# EAGLE design PI-Shield (EAGLE 9.5.0)

## Sheet 1 of 4
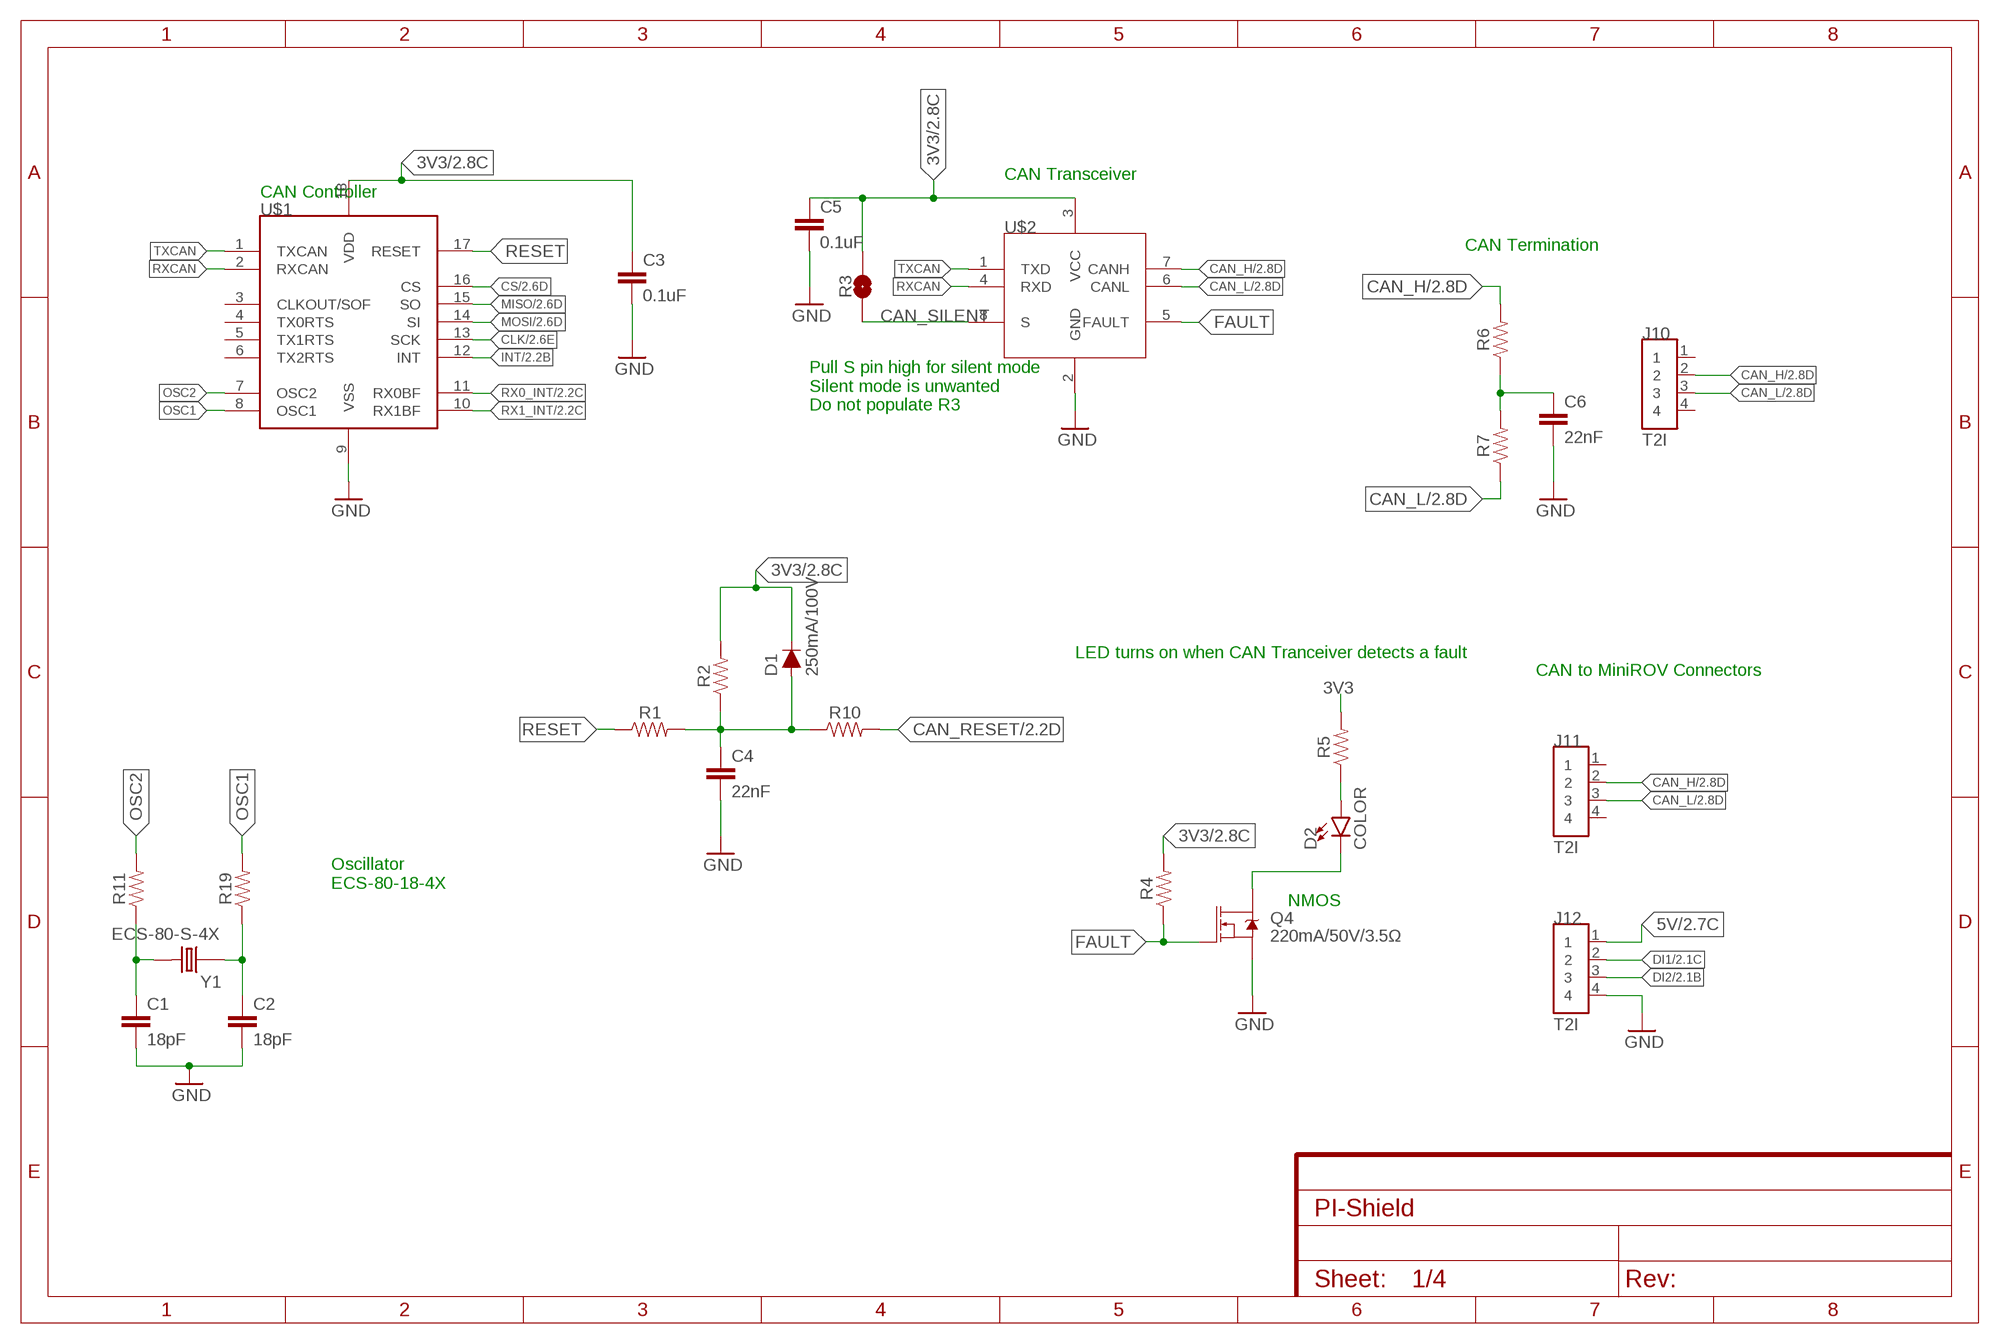
[diagram p0: schematic, sheet 1]

### Parts
C1  18pF  18PF-0603-50V-5%  [0603]
C2  18pF  18PF-0603-50V-5%  [0603]
C3  0.1uF  22NF/22,000PF-0603-50V-10%  [0603]
C4  22nF  22NF/22,000PF-0603-50V-10%  [0603]
C5  0.1uF  22NF/22,000PF-0603-50V-10%  [0603]
C6  22nF  22NF/22,000PF-0603-50V-10%  [0603]
D1  250mA/100V  DIODE-BAS16J  [SOD-323]
D2  COLOR  LED-0805  [0805]
J10  T2I  [T2I]
J11  T2I  [T2I]
J12  T2I  [T2I]
Q4  220mA/50V/3.5Ω  MOSFET-NCH-BSS138  [SOT23-3]
R1  RESISTOR0603  [0603]
R2  RESISTOR0603  [0603]
R3  JUMPER-SMT_2_NO_SILK  [SMT-JUMPER_2_NO_SILK]
R4  RESISTOR0603  [0603]
R5  RESISTOR0603  [0603]
R6  RESISTOR0603  [0603]
R7  RESISTOR0603  [0603]
R10  RESISTOR0603  [0603]
R11  RESISTOR0603  [0603]
R19  RESISTOR0603  [0603]
U$1  MCP2515  [SOIC-18]
U$2  TCAN337D  [SOIC-8]
Y1  ECS-80-S-4X  [XTAL_ECS-80-S-4X]

### Nets
3V3 [3.3V]: C3.1 C5.1 D1.C R2.2 R3.2 R4.2 R5.2 U$1.18(VDD) U$2.3(VCC) ; also sheet 2,3,4
5V [5V]: J12.1 ; also sheet 2,3,4
CAN_H [diff pair]: J10.2 J11.2 R6.2 U$2.7(CANH) ; also sheet 2,4
CAN_L [diff pair]: J10.3 J11.3 R7.1 U$2.6(CANL) ; also sheet 2,4
CAN_RESET: R10.2 ; also sheet 2
CAN_SILENT: R3.1 U$2.8(S)
CAN_TERM_COM: C6.1 R6.1 R7.2
CLK: U$1.13(SCK) ; also sheet 2
CS: U$1.16(CS) ; also sheet 2
DI1: J12.2 ; also sheet 2
DI2: J12.3 ; also sheet 2
FAULT: Q4.1(G) R4.1 U$2.5(FAULT)
GND: C1.2 C2.2 C3.2 C4.2 C5.2 C6.2 J12.4 Q4.2(S) U$1.9(VSS) U$2.2(GND) ; also sheet 2,3,4
INT: U$1.12(INT) ; also sheet 2
MISO: U$1.15(SO) ; also sheet 2
MOSI: U$1.14(SI) ; also sheet 2
N$2: C1.1 R11.1 Y1.2
N$3: C2.1 R19.1 Y1.1
N$7: D2.C Q4.3(D)
N$8: D2.A R5.1
OSC1: R19.2 U$1.8(OSC1)
OSC2: R11.2 U$1.7(OSC2)
RESET: R1.1 U$1.17(RESET)
RESET_MID: C4.1 D1.A R1.2 R2.1 R10.1
RX0_INT: U$1.11(RX0BF) ; also sheet 2
RX1_INT: U$1.10(RX1BF) ; also sheet 2
RXCAN: U$1.2(RXCAN) U$2.4(RXD)
TXCAN: U$1.1(TXCAN) U$2.1(TXD)
Unconnected: J10.1 J10.4 J11.1 J11.4 U$1.3(CLKOUT/SOF) U$1.4(TX0RTS) U$1.5(TX1RTS) U$1.6(TX2RTS)

### Notes on the sheet
- CAN Transceiver
- CAN Controller
- CAN Termination
- Pull S pin high for silent mode
  Silent mode is unwanted
  Do not populate R3
- LED turns on when CAN Tranceiver detects a fault
- CAN to MiniROV Connectors
- Oscillator
  ECS-80-18-4X
- NMOS

## Sheet 2 of 4
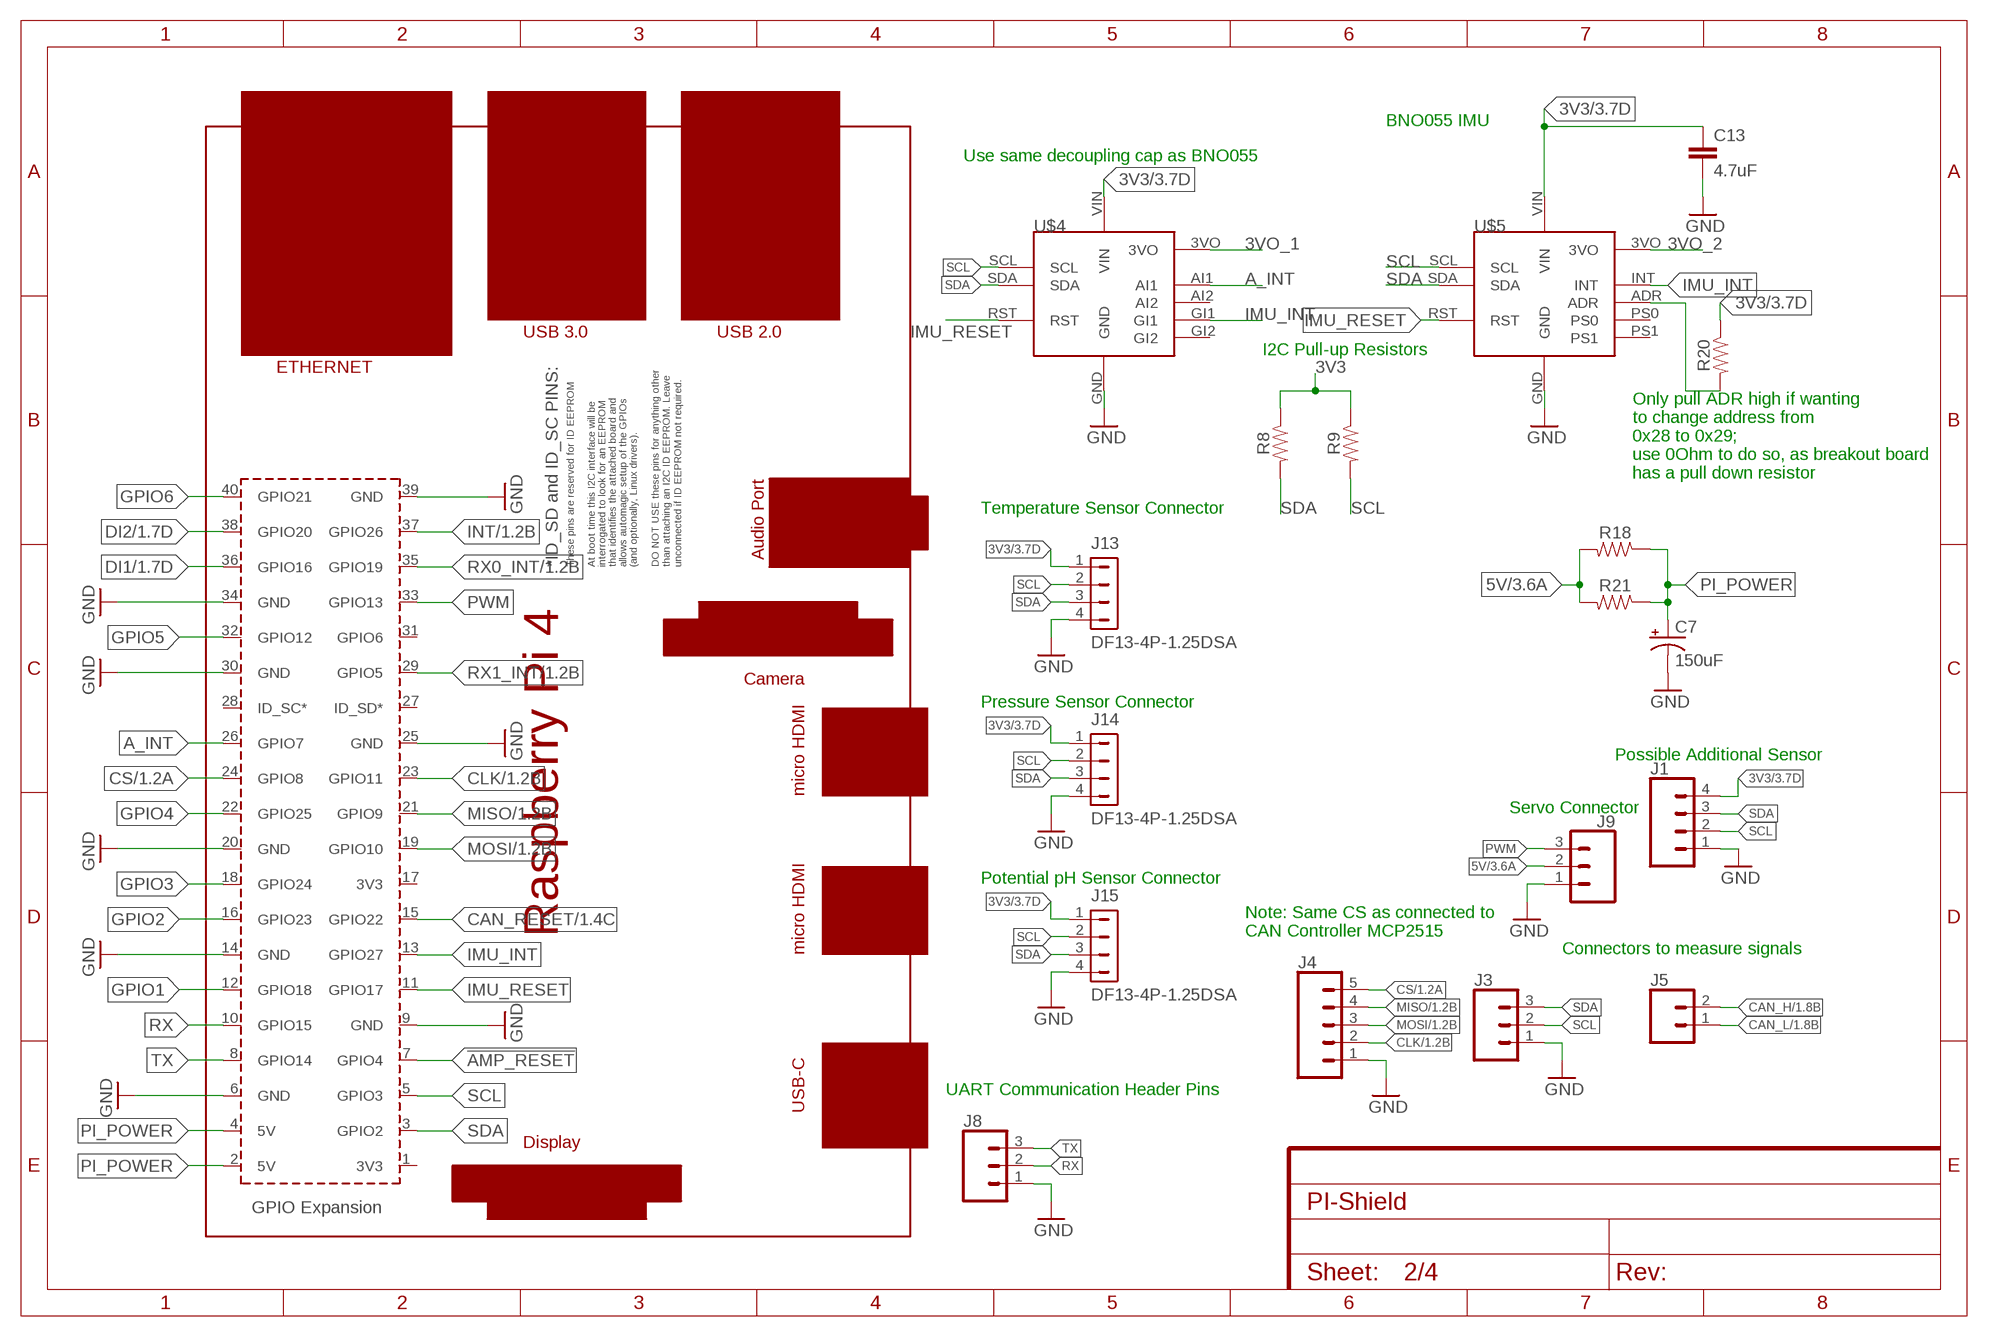
[diagram p1: schematic, sheet 2]

### Parts
C7  150uF  C-TANTALUM(10UF_150UF)  [2917(7343-31-METRIC)]
C13  4.7uF  22NF/22,000PF-0603-50V-10%  [0603]
J1  CONN_04  [1X04]
J3  CONN_03  [1X03]
J4  CONN_05  [1X05]
J5  CONN_02  [1X02]
J8  CONN_03  [1X03]
J9  CONN_03  [1X03]
J13  DF13-4P-1.25DSA  [DF13-4P-1.25DSA]
J14  DF13-4P-1.25DSA  [DF13-4P-1.25DSA]
J15  DF13-4P-1.25DSA  [DF13-4P-1.25DSA]
R8  RESISTOR0603  [0603]
R9  RESISTOR0603  [0603]
R18  RESISTOR0603  [0603]
R20  RESISTOR0603  [0603]
R21  RESISTOR0603  [0603]
U$4  ADAFRUIT-FXOS8700-FXAS21002  [ADAFRUIT-FXOS8700-FXAS21002]
U$5  ADAFRUIT-BNO055  [ADAFRUIT-BNO055]
U$8  RPI4  [RPI4]

### Nets
3V3 [3.3V]: C13.1 J1.4 J13.1 J14.1 J15.1 R8.1 R9.1 R20.1 U$4.VIN U$5.VIN ; also sheet 1,3,4
3VO_1: U$4.3VO
3VO_2: U$5.3VO
5V [5V]: J9.2 R18.2 R21.2 ; also sheet 1,3,4
!AMP_RESET: U$8.7(GPIO4) ; also sheet 3
A_INT: U$4.AI1 U$8.26(GPIO7)
CAN_H [diff pair]: J5.2 ; also sheet 1,4
CAN_L [diff pair]: J5.1 ; also sheet 1,4
CAN_RESET: U$8.15(GPIO22) ; also sheet 1
CLK: J4.2 U$8.23(GPIO11) ; also sheet 1
CS: J4.5 U$8.24(GPIO8) ; also sheet 1
DI1: U$8.36(GPIO16) ; also sheet 1
DI2: U$8.38(GPIO20) ; also sheet 1
GND: C7.- C13.2 J1.1 J3.1 J4.1 J8.1 J9.1 J13.4 J14.4 J15.4 U$4.GND U$5.GND U$8.6(GND) U$8.9(GND) U$8.14(GND) U$8.20(GND) U$8.25(GND) U$8.30(GND) U$8.34(GND) U$8.39(GND) ; also sheet 1,3,4
GPIO1: U$8.12(GPIO18) ; also sheet 4
GPIO2: U$8.16(GPIO23) ; also sheet 4
GPIO3: U$8.18(GPIO24) ; also sheet 4
GPIO4: U$8.22(GPIO25) ; also sheet 4
GPIO5: U$8.32(GPIO12) ; also sheet 4
GPIO6: U$8.40(GPIO21) ; also sheet 4
IMU_INT: U$4.GI1 U$5.INT U$8.13(GPIO27)
IMU_RESET: U$4.RST U$5.RST U$8.11(GPIO17)
INT: U$8.37(GPIO26) ; also sheet 1
MISO: J4.4 U$8.21(GPIO9) ; also sheet 1
MOSI: J4.3 U$8.19(GPIO10) ; also sheet 1
N$1: R20.2 U$5.ADR
PI_POWER: C7.+ R18.1 R21.1 U$8.2(5V) U$8.4(5V)
PWM: J9.3 U$8.33(GPIO13)
RX: J8.2 U$8.10(GPIO15)
RX0_INT: U$8.35(GPIO19) ; also sheet 1
RX1_INT: U$8.29(GPIO5) ; also sheet 1
SCL: J1.2 J3.2 J13.2 J14.2 J15.2 R9.2 U$4.SCL U$5.SCL U$8.5(GPIO3) ; also sheet 3
SDA: J1.3 J3.3 J13.3 J14.3 J15.3 R8.2 U$4.SDA U$5.SDA U$8.3(GPIO2) ; also sheet 3
TX: J8.3 U$8.8(GPIO14)
Unconnected: U$4.AI2 U$4.GI2 U$5.PS0 U$5.PS1 U$8.1(3V3) U$8.17(3V3) U$8.27(ID_SD*) U$8.28(ID_SC*) U$8.31(GPIO6)

### Notes on the sheet
- BNO055 IMU
- Use same decoupling cap as BNO055
- I2C Pull-up Resistors
- Only pull ADR high if wanting
  to change address from
  0x28 to 0x29;
  use 0Ohm to do so, as breakout board
  has a pull down resistor
- Temperature Sensor Connector
- Pressure Sensor Connector
- Possible Additional Sensor
- Servo Connector
- Potential pH Sensor Connector
- Note: Same CS as connected to 
  CAN Controller MCP2515
- Connectors to measure signals
- UART Communication Header Pins

## Sheet 3 of 4
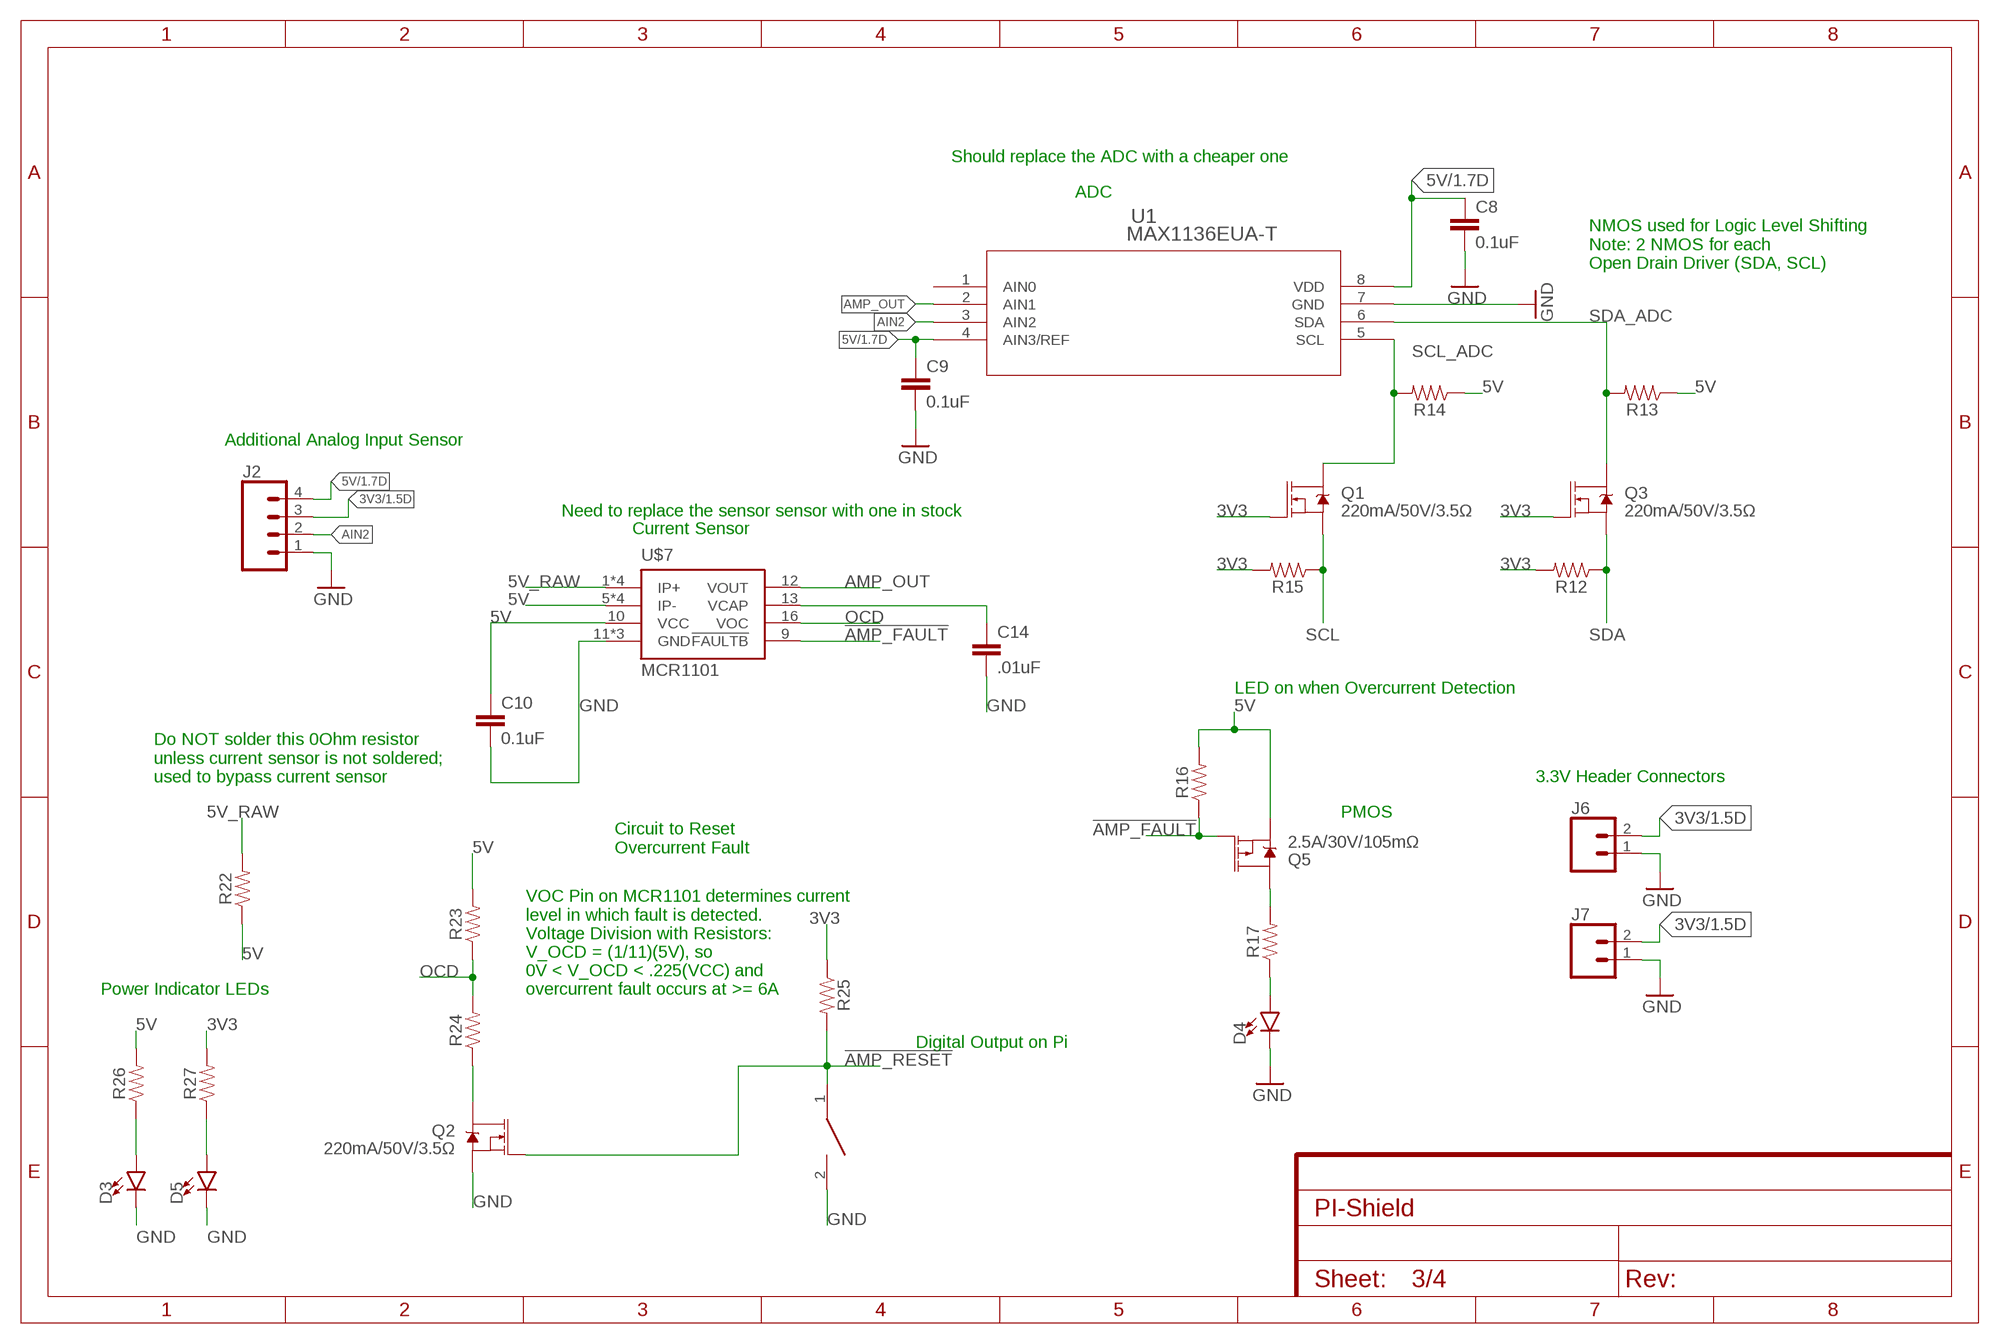
[diagram p2: schematic, sheet 3]

### Parts
C8  0.1uF  22NF/22,000PF-0603-50V-10%  [0603]
C9  0.1uF  22NF/22,000PF-0603-50V-10%  [0603]
C10  0.1uF  22NF/22,000PF-0603-50V-10%  [0603]
C14  .01uF  22NF/22,000PF-0603-50V-10%  [0603]
D3  LED0603  [LED-0603]
D4  LED0603  [LED-0603]
D5  LED0603  [LED-0603]
J2  CONN_04  [1X04]
J6  CONN_02  [1X02]
J7  CONN_02  [1X02]
Q1  220mA/50V/3.5Ω  MOSFET-NCH-BSS138  [SOT23-3]
Q2  220mA/50V/3.5Ω  MOSFET-NCH-BSS138  [SOT23-3]
Q3  220mA/50V/3.5Ω  MOSFET-NCH-BSS138  [SOT23-3]
Q5  2.5A/30V/105mΩ  MOSFET_PCH-DMG2307L  [SOT23-3]
R12  RESISTOR0603  [0603]
R13  RESISTOR0603  [0603]
R14  RESISTOR0603  [0603]
R15  RESISTOR0603  [0603]
R16  RESISTOR0603  [0603]
R17  RESISTOR0603  [0603]
R22  RESISTOR0603  [0603]
R23  RESISTOR0603  [0603]
R24  RESISTOR0603  [0603]
R25  RESISTOR0603  [0603]
R26  RESISTOR0603  [0603]
R27  RESISTOR0603  [0603]
U1  MAX1136EUA-T  [21-0036K]
U$6  DISCRETECOMPONENTS_SWITCH  [DISCRETECOMPONENTS_SW_2512]
U$7  MCR1101  [SOIC-16]

### Nets
3V3 [3.3V]: J2.3 J6.2 J7.2 Q1.1(G) Q3.1(G) R12.2 R15.2 R25.1 R27.2 ; also sheet 1,2,4
5V [5V]: C8.1 C9.1 C10.1 J2.4 Q5.2(S) R13.1 R14.1 R16.2 R22.1 R23.2 R26.2 U1.4(AIN3/REF) U1.8(VDD) U$7.5(IP-) U$7.6(IP-) U$7.7(IP-) U$7.8(IP-) U$7.10(VCC) ; also sheet 1,2,4
5V_RAW: R22.2 U$7.1(IP+) U$7.2(IP+) U$7.3(IP+) U$7.4(IP+)
!AMP_FAULT: Q5.1(G) R16.1 U$7.9(!FAULTB)
!AMP_RESET: Q2.1(G) R25.2 U$6.1 ; also sheet 2
AIN2: J2.2 U1.3(AIN2)
AMP_OUT: U1.2(AIN1) U$7.12(VOUT)
GND: C8.2 C9.2 C10.2 C14.2 D3.C D4.C D5.C J2.1 J6.1 J7.1 Q2.2(S) U1.7(GND) U$6.2 U$7.11(GND) U$7.14(GND) U$7.15(GND) ; also sheet 1,2,4
N$6: C14.1 U$7.13(VCAP)
N$9: D3.A R26.1
N$10: Q5.3(D) R17.2
N$11: D4.A R17.1
N$12: D5.A R27.1
N$13: Q2.3(D) R24.1
OCD: R23.1 R24.2 U$7.16(VOC)
SCL: Q1.2(S) R15.1 ; also sheet 2
SCL_ADC: Q1.3(D) R14.2 U1.5(SCL)
SDA: Q3.2(S) R12.1 ; also sheet 2
SDA_ADC: Q3.3(D) R13.2 U1.6(SDA)
Unconnected: U1.1(AIN0)

### Notes on the sheet
- Should replace the ADC with a cheaper one
- ADC
- NMOS used for Logic Level Shifting
  Note: 2 NMOS for each 
  Open Drain Driver (SDA, SCL)
- Additional Analog Input Sensor
- Need to replace the sensor sensor with one in stock
- Current Sensor
- LED on when Overcurrent Detection
- Do NOT solder this 0Ohm resistor
  unless current sensor is not soldered;
  used to bypass current sensor
- 3.3V Header Connectors
- PMOS
- Circuit to Reset
  Overcurrent Fault
- Power Indicator LEDs
- VOC Pin on MCR1101 determines current
  level in which fault is detected.
  Voltage Division with Resistors:
  V_OCD = (1/11)(5V), so
  0V < V_OCD < .225(VCC) and
  overcurrent fault occurs at >= 6A
- Digital Output on Pi

## Sheet 4 of 4
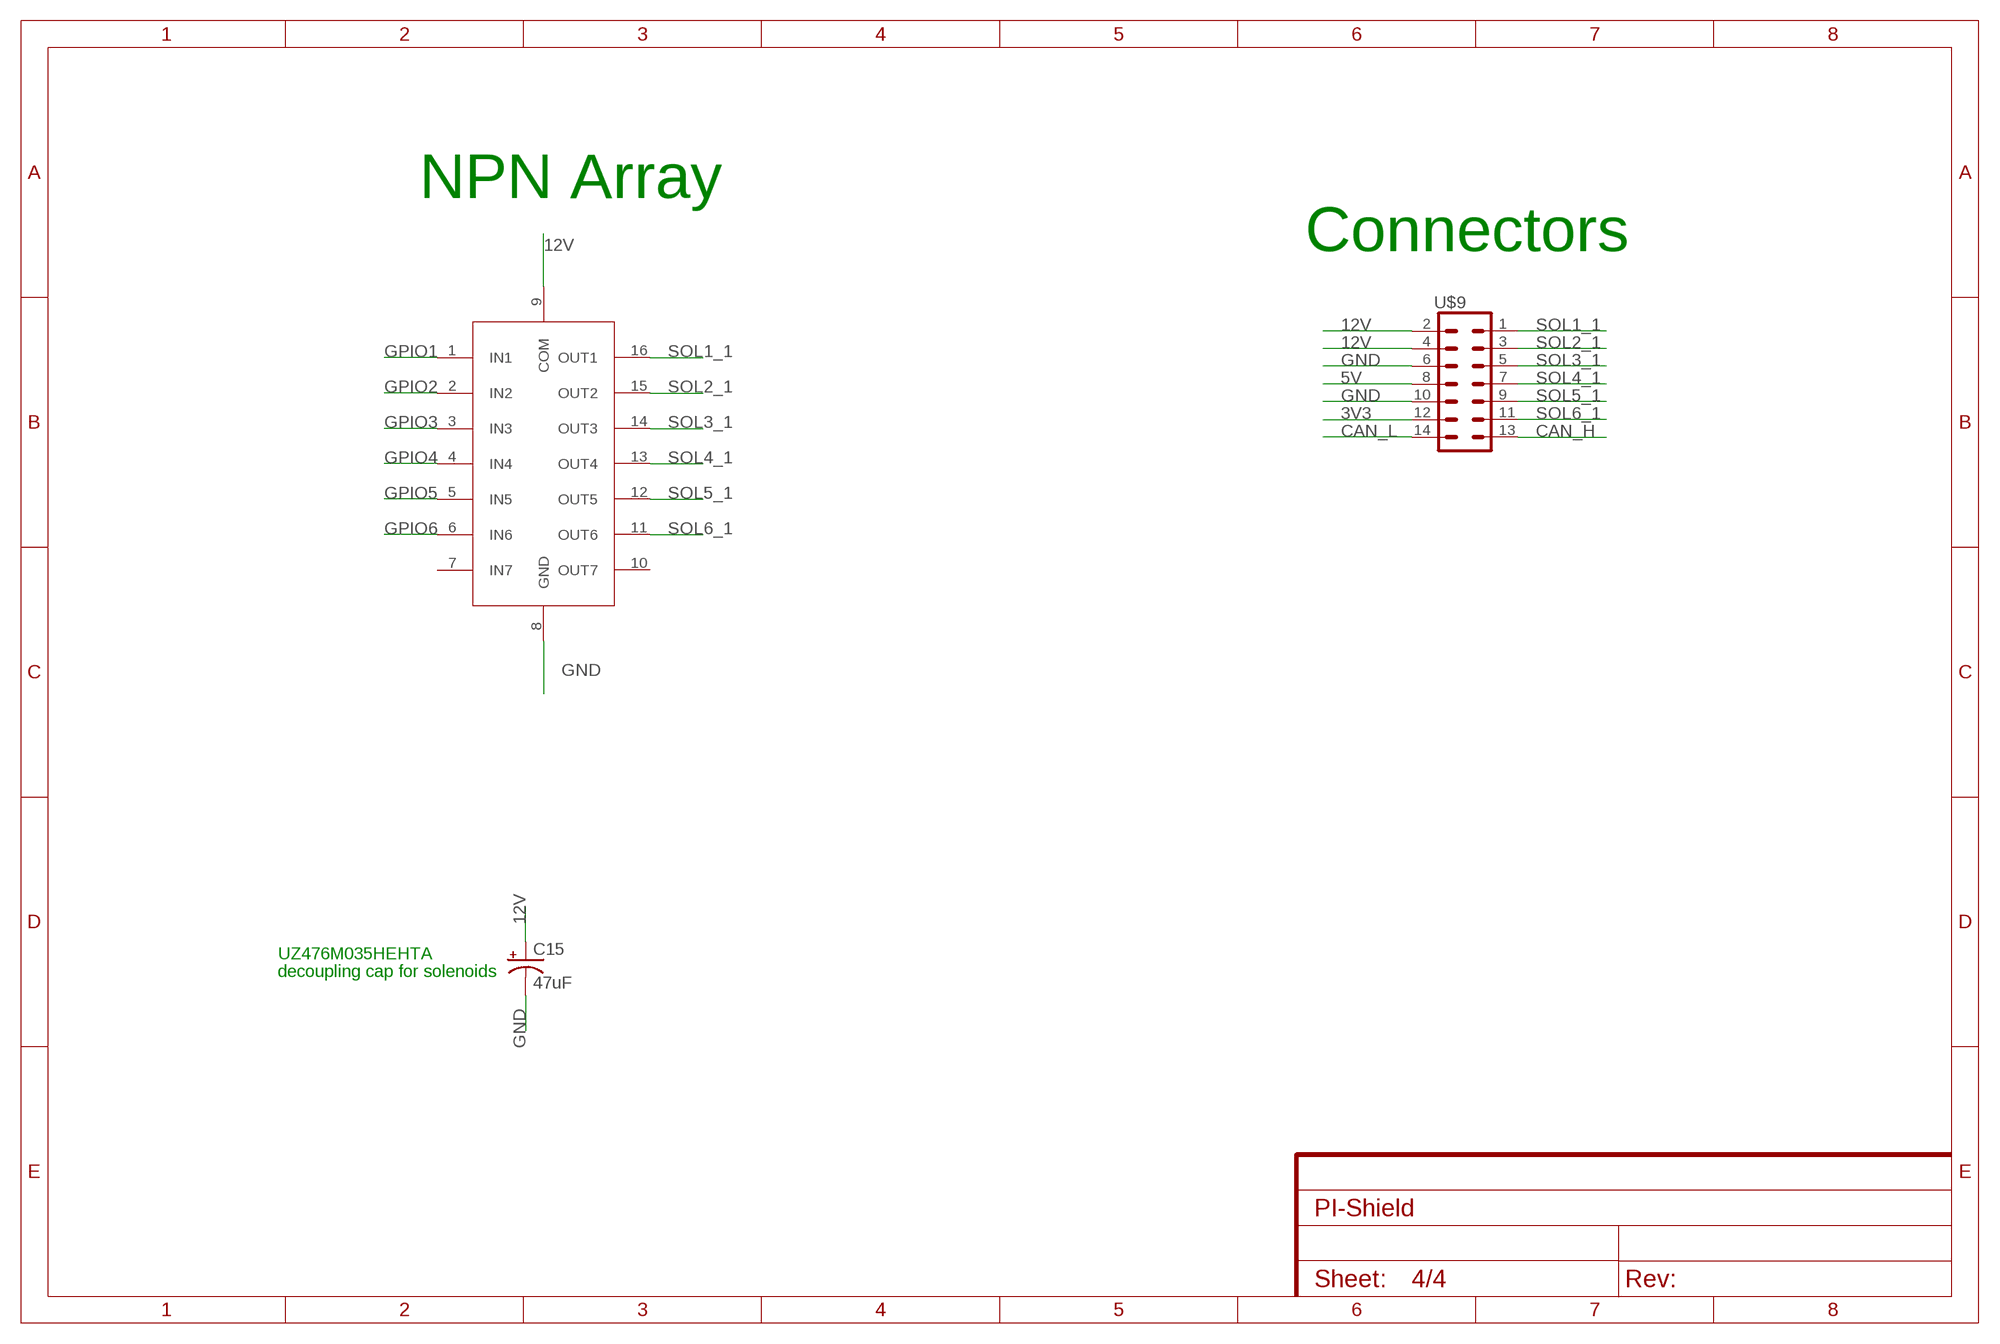
[diagram p3: schematic, sheet 4]

### Parts
C15  47uF  47UF-POLAR-PANASONIC_D-35V-20%  [PANASONIC_D]
U3  ULN2003V12  [ULN2003V12]
U$9  7X_CONN  [IPL7X2]

### Nets
3V3 [3.3V]: U$9.12 ; also sheet 1,2,3
5V [5V]: U$9.8 ; also sheet 1,2,3
12V: C15.+ U3.9(COM) U$9.2 U$9.4
CAN_H [diff pair]: U$9.13 ; also sheet 1,2
CAN_L [diff pair]: U$9.14 ; also sheet 1,2
GND: C15.- U3.8(GND) U$9.6 U$9.10 ; also sheet 1,2,3
GPIO1: U3.1(IN1) ; also sheet 2
GPIO2: U3.2(IN2) ; also sheet 2
GPIO3: U3.3(IN3) ; also sheet 2
GPIO4: U3.4(IN4) ; also sheet 2
GPIO5: U3.5(IN5) ; also sheet 2
GPIO6: U3.6(IN6) ; also sheet 2
SOL1_1: U3.16(OUT1) U$9.1
SOL2_1: U3.15(OUT2) U$9.3
SOL3_1: U3.14(OUT3) U$9.5
SOL4_1: U3.13(OUT4) U$9.7
SOL5_1: U3.12(OUT5) U$9.9
SOL6_1: U3.11(OUT6) U$9.11
Unconnected: U3.7(IN7) U3.10(OUT7)

### Notes on the sheet
- NPN Array
- Connectors
- UZ476M035HEHTA
- decoupling cap for solenoids

## Library data of the parts
C1 C2 = SparkFun-Capacitors:18PF: 18pF ceramic capacitors A capacitor is a passive two-terminal electrical component used to store electrical energy temporarily in an electric field.; PROD_ID: CAP-08267
C3 C5 C8-C10 C13 C14 = SparkFun-Capacitors:22NF/22,000PF: 0.022uF/22nF/22,000pF ceramic capacitors A capacitor is a passive two-terminal electrical component used to store electrical energy temporarily in an electric field.; PROD_ID: CAP-07885; VALUE: 22nF
C4 C6 = SparkFun-Capacitors:22NF/22,000PF: 0.022uF/22nF/22,000pF ceramic capacitors A capacitor is a passive two-terminal electrical component used to store electrical energy temporarily in an electric field.; PROD_ID: CAP-07885
C7 = Tantalum Cap 150 uF - Kemet 2917 T491:C-TANTALUM(10UF_150UF)
C15 = SparkFun-Capacitors:47UF-POLAR: 47µF polarized capacitors A capacitor is a passive two-terminal electrical component used to store electrical energy temporarily in an electric field.; PROD_ID: CAP-08478
D1 = SparkFun-DiscreteSemi:DIODE: Diode These are standard reverse protection diodes and small signal diodes. SparkFun Products: SparkFun SparkPunk Sound Kit <https://www.sparkfun.com/products/11177> SparkFun ESP8266 Thing <https://www.sparkfun.com/products/13231>; PROD_ID: DIO-09646
D2 = LED-0805:LED-0805
D3-D5 = SparkFun-LED:LED: LED (Generic) Standard schematic elements and footprints for 5mm, 3mm, 1206, and 0603 sized LEDs. Generic LEDs with no color specified.
J1 J2 = SparkFun-Connectors:CONN_04: Multi connection point. Often used as Generic Header-pin footprint for 0.1 inch spaced/style header connections On any of the 0.1 inch spaced packages, you can populate with these: Break Away Headers - Straight <https://www.sparkfun.com/products/116> (PRT-00116) Break Away Male Headers - Right Angle <https://www.sparkfun.com/products/553> (PRT-00553) Female Headers <https://www.sparkfun.com/products/115> (PRT-00115) Break Away Headers - Machine Pin <https://www.sparkfun.com/products/117> (PRT-00117) Break Away Female Headers - Swiss Machine Pin <https://www.sparkfun.com/products/743> (PRT-00743) For SCREWTERMINALS and SPRING TERMINALS visit here: Screw Terimnals on SparkFun.com <https://www.sparkfun.com/search/results?term=Screw+Terminals> (5mm/3.5mm/2.54mm spacing) This device is also useful as a general connection point to wire up your design to another part of your project. Our various solder wires solder well into these plated through hole pads. Hook-Up Wire - Assortment (Stranded, 22 AWG) <https://www.sparkfun.com/products/11375> (PRT-11375) Hook-Up Wire - Assortment (Solid Core, 22 AWG) <https://www.sparkfun.com/products/11367> (PRT-11367) View the entire wire category on our website here <https://www.sparkfun.com/categories/141> Special notes: Molex polarized connector foot print use with SKU : PRT-08231 with associated crimp pins and housings. 1MM SMD Version SKU: PRT-10208; PROD_ID: CONN-09696
J3 J8 J9 = SparkFun-Connectors:CONN_03: Multi connection point. Often used as Generic Header-pin footprint for 0.1 inch spaced/style header connections On any of the 0.1 inch spaced packages, you can populate with these: Break Away Headers - Straight <https://www.sparkfun.com/products/116> (PRT-00116) Break Away Male Headers - Right Angle <https://www.sparkfun.com/products/553> (PRT-00553) Female Headers <https://www.sparkfun.com/products/115> (PRT-00115) Break Away Headers - Machine Pin <https://www.sparkfun.com/products/117> (PRT-00117) Break Away Female Headers - Swiss Machine Pin <https://www.sparkfun.com/products/743> (PRT-00743) Stackable Header - 3 Pin (Female, 0.1") <https://www.sparkfun.com/products/13875> (PRT-13875) For SCREWTERMINALS and SPRING TERMINALS visit here: Screw Terimnals on SparkFun.com <https://www.sparkfun.com/search/results?term=Screw+Terminals> (5mm/3.5mm/2.54mm spacing) This device is also useful as a general connection point to wire up your design to another part of your project. Our various solder wires solder well into these plated through hole pads. Hook-Up Wire - Assortment (Stranded, 22 AWG) <https://www.sparkfun.com/products/11375> (PRT-11375) Hook-Up Wire - Assortment (Solid Core, 22 AWG) <https://www.sparkfun.com/products/11367> (PRT-11367) View the entire wire category on our website here <https://www.sparkfun.com/categories/141> Special notes: Molex polarized connector foot print use with SKU : PRT-08232 with associated crimp pins and housings.
J4 = SparkFun-Connectors:CONN_05: Multi connection point. Often used as Generic Header-pin footprint for 0.1 inch spaced/style header connections On any of the 0.1 inch spaced packages, you can populate with these: Break Away Headers - Straight <https://www.sparkfun.com/products/116> (PRT-00116) Break Away Male Headers - Right Angle <https://www.sparkfun.com/products/553> (PRT-00553) Female Headers <https://www.sparkfun.com/products/115> (PRT-00115) Break Away Headers - Machine Pin <https://www.sparkfun.com/products/117> (PRT-00117) Break Away Female Headers - Swiss Machine Pin <https://www.sparkfun.com/products/743> (PRT-00743) For SCREWTERMINALS and SPRING TERMINALS visit here: Screw Terimnals on SparkFun.com <https://www.sparkfun.com/search/results?term=Screw+Terminals> (5mm/3.5mm/2.54mm spacing) This device is also useful as a general connection point to wire up your design to another part of your project. Our various solder wires solder well into these plated through hole pads. Hook-Up Wire - Assortment (Stranded, 22 AWG) <https://www.sparkfun.com/products/11375> (PRT-11375) Hook-Up Wire - Assortment (Solid Core, 22 AWG) <https://www.sparkfun.com/products/11367> (PRT-11367) View the entire wire category on our website here <https://www.sparkfun.com/categories/141> Special notes: Molex polarized connector foot print use with SKU : PRT-08231 with associated crimp pins and housings. 1MM SMD Version SKU: PRT-10208
J5-J7 = SparkFun-Connectors:CONN_02: Multi connection point. Often used as Generic Header-pin footprint for 0.1 inch spaced/style header connections On any of the 0.1 inch spaced packages, you can populate with these: Break Away Headers - Straight <https://www.sparkfun.com/products/116> (PRT-00116) Break Away Male Headers - Right Angle <https://www.sparkfun.com/products/553> (PRT-00553) Female Headers <https://www.sparkfun.com/products/115> (PRT-00115) Break Away Headers - Machine Pin <https://www.sparkfun.com/products/117> (PRT-00117) Break Away Female Headers - Swiss Machine Pin <https://www.sparkfun.com/products/743> (PRT-00743) For SCREWTERMINALS and SPRING TERMINALS visit here: Screw Terimnals on SparkFun.com <https://www.sparkfun.com/search/results?term=Screw+Terminals> (5mm/3.5mm/2.54mm spacing) This device is also useful as a general connection point to wire up your design to another part of your project. Our various solder wires solder well into these plated through hole pads. Hook-Up Wire - Assortment (Stranded, 22 AWG) <https://www.sparkfun.com/products/11375> (PRT-11375) Hook-Up Wire - Assortment (Solid Core, 22 AWG) <https://www.sparkfun.com/products/11367> (PRT-11367) View the entire wire category on our website here <https://www.sparkfun.com/categories/141> Special notes: Molex polarized connector foot print use with: PRT-08233 with associated crimp pins and housings. 2.54_SCREWTERM for use with PRT-10571. 3.5mm Screw Terminal footprints for PRT-08084 5mm Screw Terminal footprints for use with PRT-08432
J10-J12 = Samtec t2i:T2I
J13-J15 = con-hirose-df13:DF13-4P-1.25: DF13-4P 1.25mm Pitch Miniature Crimping Connector.
Q1-Q4 = SparkFun-DiscreteSemi:MOSFET-NCH: N-channel MOSFETs Voltage controlled devices that allow control of high current outputs. SparkFun Products: SparkFun OpenScale <https://www.sparkfun.com/products/13261> SparkFun Digital Sandbox <https://www.sparkfun.com/products/12651> SparkFun Monster Moto Shield <https://www.sparkfun.com/products/10182> SparkFun MOSFET Power Controller <https://www.sparkfun.com/products/11214>; PROD_ID: TRANS-00830
Q5 = SparkFun-DiscreteSemi:MOSFET_PCH: P-channel MOSFETs Voltage controlled devices that allow control of high current outputs. SparkFun Products: SparkFun ESP32 Thing <https://www.sparkfun.com/products/13907> SparkFun ESP8266 Thing <https://www.sparkfun.com/products/13231>; PROD_ID: TRANS-11308
R1 R2 R4-R27 = SparkFun-Resistors:RESISTOR: Generic Resistor Package
R3 = SparkFun-Jumpers:JUMPER-SMT_2_NO: Normally open jumper This jumper has two pads in close proximity to each other. Apply solder to close the connection. Round pads are easier to solder for beginners, but are a lot larger. SparkFun Product that uses the round pads: SparkFun EL Sequencer <https://www.sparkfun.com/products/12781>
U1 = MAX1136EUA-T:MAX1136EUA-T; DESCRIPTION: 2.7V to 3.6V and 4.5V to 5.5V, Low-Power, 4-/12-Channel, 2-Wire Serial 10-Bit AD; DIGI-KEY_PART_NUMBER: MAX1136EUA+-ND; DIGI-KEY_PURCHASE_URL: https://www.digikey.com/product-detail/en/maxim-integrated/MAX1136EUA-/MAX1136EUA--ND/1159953?utm_source=snapeda&utm_medium=aggregator&utm_campaign=symbol; MF: Maxim Integrated; MP: MAX1136EUA+; PACKAGE: MSOP-8 Maxim Integrated
U3 = ULN2003V12:ULN2003V12; A1_MIN: 0.25; A_MAX: 1.75; A_MIN: 1.75; A_NOM: 1.75; B_MAX: 0.51; B_MIN: 0.33; B_NOM: 0.42; D2_MAX: 0.0; D_MAX: 10.0; D_MIN: 9.8; D_NOM: 9.9; E1_MAX: 4.0; E1_MIN: 3.8; E1_NOM: 3.9; E2_MAX: 0.0; ENOM: 1.27; E_MAX: 6.2; E_MIN: 5.8; E_NOM: 6.0; L_MAX: 1.27; L_MIN: 0.38; L_NOM: 0.825; MANUFACTURER: Diodes Inc.; PIN_COUNT: 16.0; SNAPEDA_PACKAGE_ID: 27538; STANDARD: IPC 7351B
U$1 = STM and CAN parts:MCP2515
U$2 = STM and CAN parts:TCAN337D
U$4 = Adafruit IMUs - BNO055 and FX:ADAFRUIT-FXOS8700-FXAS21002
U$5 = Adafruit IMUs - BNO055 and FX:ADAFRUIT-BNO055
U$6 = Push button - FSM2JMTR:DISCRETECOMPONENTS_SWITCH: TE Connectivity FSM2JMTR Switch
U$7 = MCR1101:MCR1101
U$8 = RaspberryPi:RPI4
U$9 = PI-SHIELD, Solenoid-Backplane:7X_CONN
Y1 = ECS-80-S-4X:ECS-80-S-4X: CRYSTAL T/H; DESCRIPTION: Crystal 8MHz Series 2-Pin HC-49/U; DIGI-KEY_PART_NUMBER: X1057-ND; DIGI-KEY_PURCHASE_URL: https://www.digikey.com/product-detail/en/ecs-inc/ECS-80-S-4X/X1057-ND/827549?utm_source=snapeda&utm_medium=aggregator&utm_campaign=symbol; MF: ECS International; MP: ECS-80-S-4X; PACKAGE: HC-49/US ECS International

## Net classes
1 diff pair: width 0.203 mm, clearance 0.203 mm
2 5V: width 0.508 mm
3 3.3V: width 0.508 mm

## Board
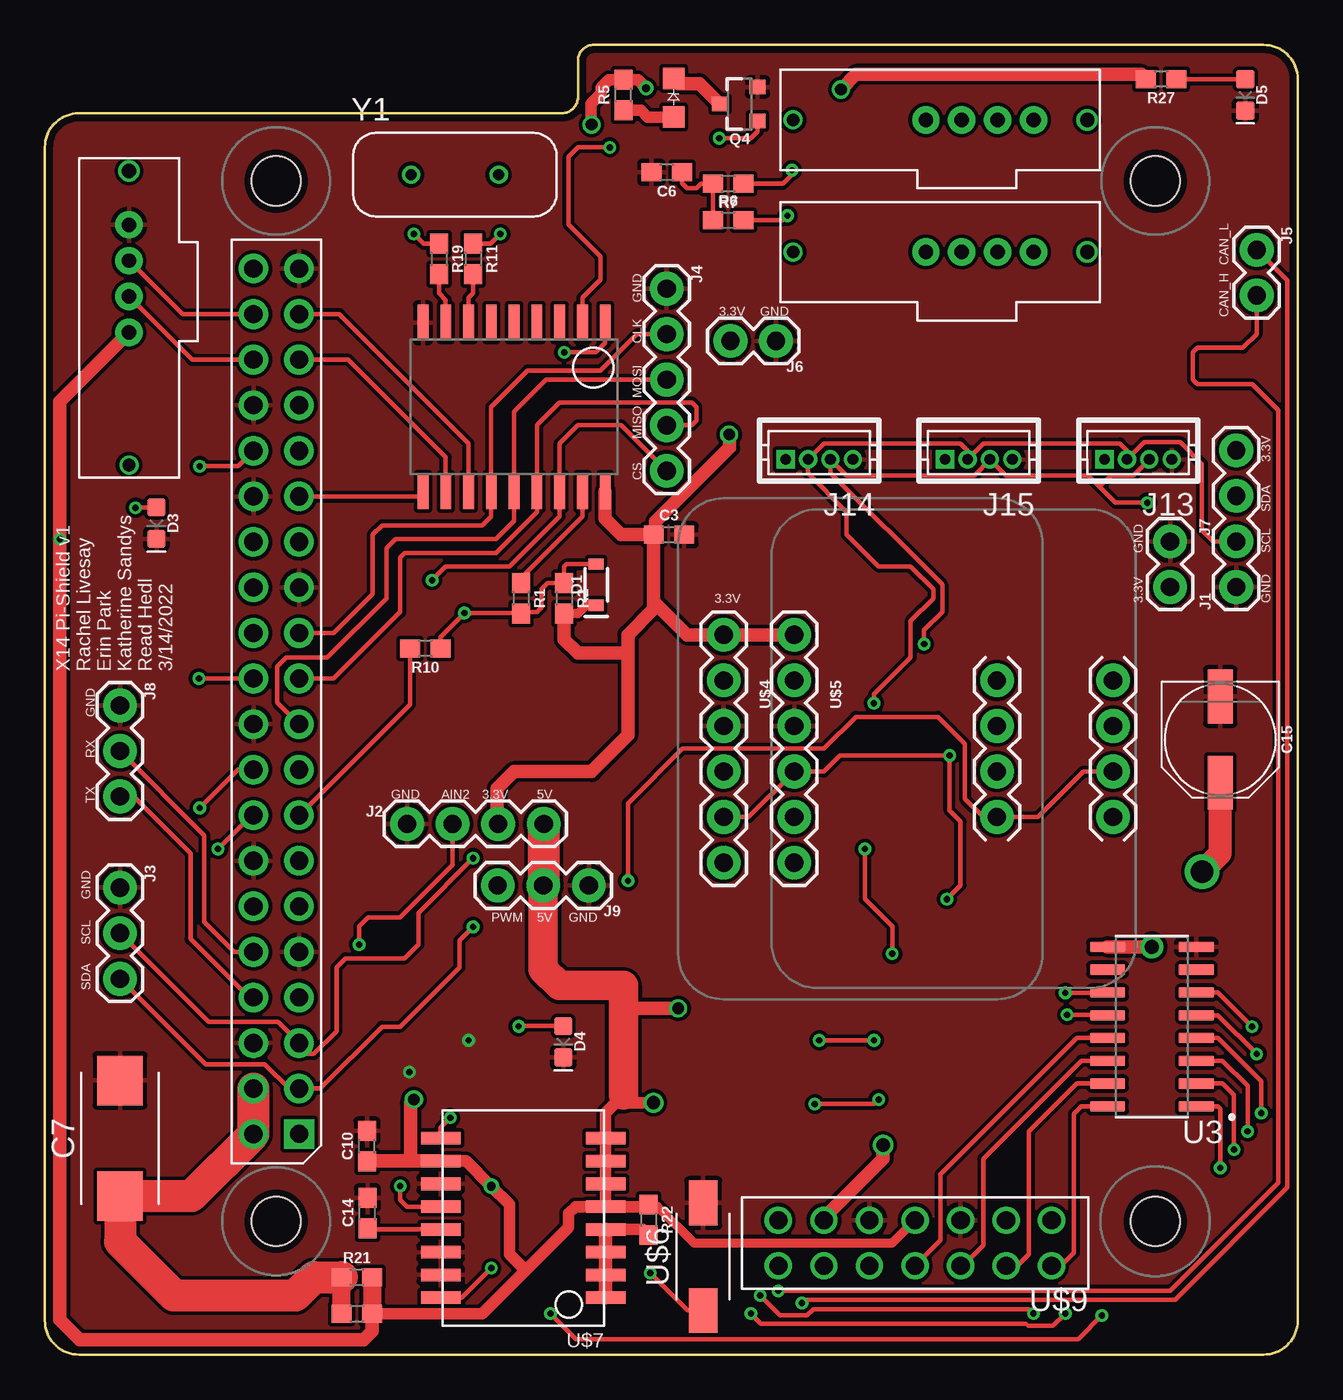
[diagram p4: board, top side]
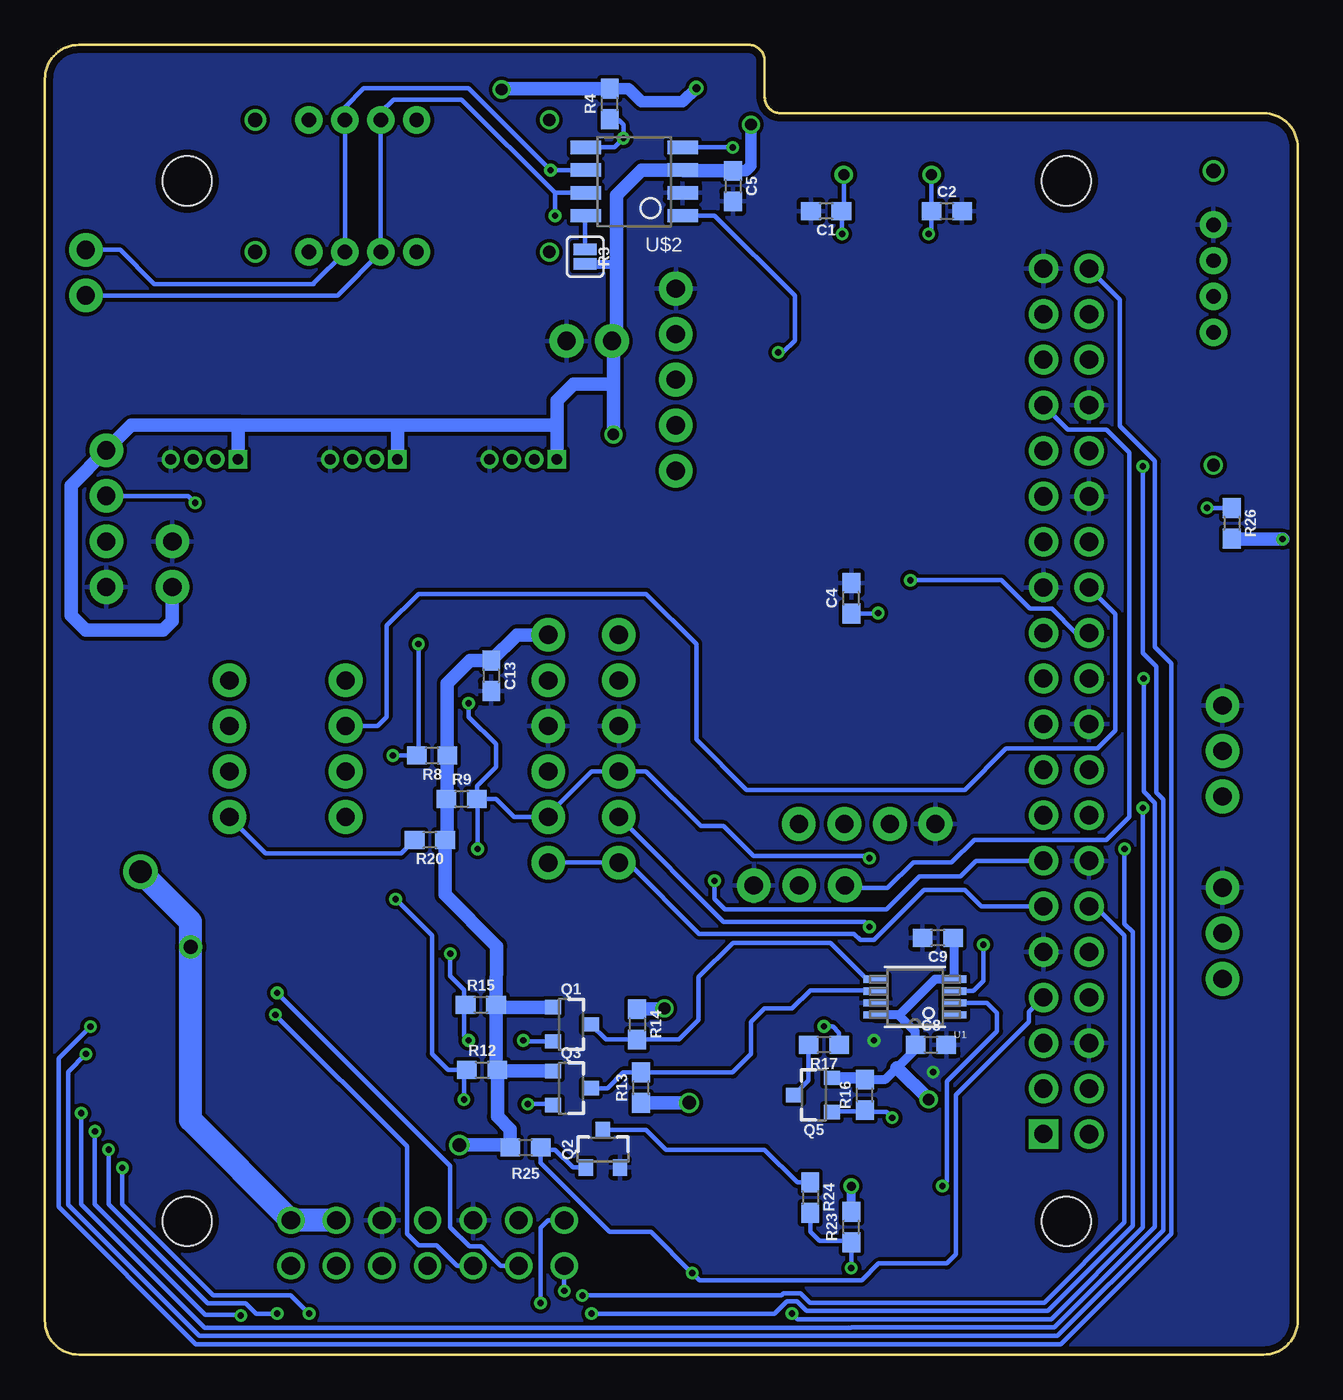
[diagram p5: board, bottom side, seen from below]

Size 69.85 x 73.03 mm. Coordinates in mm from the lower left corner, seen from the top.
Outline: 1.91,69.22 28.83,69.22 arc90 29.72,70.1 29.72,72.14 arc-90 30.61,73.03 67.94,73.03 arc-90 69.85,71.12 69.85,1.91 arc-90 67.94,0 1.91,0 arc-90 0,1.91 0,67.31 arc-90 1.91,69.22
Copper layers (1*16): Top 0.0356mm / dielectric 1.5011mm / Bottom 0.0356mm
Design rules "ECE_Senior_Design": minimum track width 8mil, minimum drill 13mil, track to track 8mil, track to pad 8mil, pad to pad 6mil, via to via 8mil, smd to smd 6mil, copper to edge 15mil, drill to drill 8mil, minimum pad ring 7mil, minimum via ring 7mil, stop-mask expansion 3mil, vias tented up to drill 0mil, thermal gap 10mil

### Footprints (pad centres in the part's own frame; a part is rotated, then mirrored left to right if it is on the bottom)
0603 = smd 1.1 x 1: 1 -0.85,0; 2 0.85,0
2917(7343-31-METRIC) = smd 2.77 x 2.55: + -3.22,0; - 3.22,0
PANASONIC_D = smd 3 x 1.4: + 2.4,0; - -2.4,0
SOD-323 = smd 0.63 x 0.83: A 1.15,0; C -1.15,0
0805 = smd 1.2 x 1.2: A 1.1,0; C -1.05,0
LED-0603 = smd 1 x 1: A -0.877,0; C 0.877,0
1X04 = drill 1.016 pad 1.88: 1 0,0; 2 2.54,0; 3 5.08,0; 4 7.62,0
1X03 = drill 1.016 pad 1.88: 1 0,0; 2 2.54,0; 3 5.08,0
1X05 = drill 1.016 pad 1.88: 1 0,0; 2 2.54,0; 3 5.08,0; 4 7.62,0; 5 10.16,0
1X02 = drill 1.016 pad 1.88: 1 0,0; 2 2.54,0
T2I = drill 0.8 pad 1.524: 1 8.1,2.8; 2 10.1,2.8; 3 12.1,2.8; 4 14.1,2.8 | drill 0.7: S1 0.7,2.8 | drill 0.8: S2 17.1,2.8
DF13-4P-1.25DSA = drill 0.6 pad 1.016 square: 1 1.875,0 | drill 0.6 pad 1.016: 2 0.625,0; 3 -0.625,0; 4 -1.875,0
SOT23-3 = smd 0.8 x 0.9: 1 -0.95,-1; 2 0.95,-1; 3 0,1.1
SMT-JUMPER_2_NO_SILK = smd 0.635 x 1.27: 1 -0.406,0; 2 0.406,0
21-0036K = smd 1.372 x 0.406: 1 -2.184,0.991; 2 -2.184,0.33; 3 -2.184,-0.33; 4 -2.184,-0.991; 5 2.184,-0.991; 6 2.184,-0.33; 7 2.184,0.33; 8 2.184,0.991
ULN2003V12 = smd 1.97 x 0.6: 1 -2.475,4.445; 2 -2.475,3.175; 3 -2.475,1.905; 4 -2.475,0.635; 5 -2.475,-0.635; 6 -2.475,-1.905; 7 -2.475,-3.175; 8 -2.475,-4.445; 9 2.475,-4.445; 10 2.475,-3.175; 11 2.475,-1.905; 12 2.475,-0.635; 13 2.475,0.635; 14 2.475,1.905; 15 2.475,3.175; 16 2.475,4.445
SOIC-18 = smd 2 x 0.6: 1 0,10.16; 2 0,8.89; 3 0,7.62; 4 0,6.35; 5 0,5.08; 6 0,3.81; 7 0,2.54; 8 0,1.27; 9 0,0; 10 9.4,0; 11 9.4,1.27; 12 9.4,2.54; 13 9.4,3.81; 14 9.4,5.08; 15 9.4,6.35; 16 9.4,7.62; 17 9.4,8.89; 18 9.4,10.16
SOIC-8 = smd 1.7 x 0.75: 1 0,3.81; 2 0,2.54; 3 0,1.27; 4 0,0; 5 5.4,0; 6 5.4,1.27; 7 5.4,2.54; 8 5.4,3.81
ADAFRUIT-FXOS8700-FXAS21002 = drill 1.016 pad 1.88: 3VO 10.16,2.54; AI1 12.7,17.78; AI2 10.16,17.78; GI1 17.78,17.78; GI2 15.24,17.78; GND 12.7,2.54; RST 20.32,2.54; SCL 15.24,2.54; SDA 17.78,2.54; VIN 7.62,2.54
ADAFRUIT-BNO055 = drill 1.016 pad 1.88: 3VO 9.525,1.27; ADR 17.145,19.05; GND 12.065,1.27; INT 14.605,19.05; PS0 9.525,19.05; PS1 12.065,19.05; RST 19.685,1.27; SCL 17.145,1.27; SDA 14.605,1.27; VIN 6.985,1.27
DISCRETECOMPONENTS_SW_2512 = smd 2.5 x 1.6: 1 -3,0; 2 3,0
SOIC-16 = smd 2.2 x 0.7: 1 -4.6,4.445; 2 -4.6,3.175; 3 -4.6,1.905; 4 -4.6,0.635; 5 -4.6,-0.635; 6 -4.6,-1.905; 7 -4.6,-3.175; 8 -4.6,-4.445; 9 4.6,-4.445; 10 4.6,-3.175; 11 4.6,-1.905; 12 4.6,-0.635; 13 4.6,0.635; 14 4.6,1.905; 15 4.6,3.175; 16 4.6,4.445
RPI4 = drill 1.016 pad 1.651 square: 1 8.37,51.23 | drill 1.016 pad 1.651: 2 8.357,53.772; 3 10.897,51.232; 4 10.897,53.772; 5 13.437,51.232; 6 13.437,53.772; 7 15.977,51.232; 8 15.977,53.772; 9 18.517,51.232; 10 18.517,53.772; 11 21.057,51.232; 12 21.057,53.772; 13 23.597,51.232; 14 23.597,53.772; 15 26.137,51.232; 16 26.137,53.772; 17 28.677,51.232; 18 28.677,53.772; 19 31.217,51.232; 20 31.217,53.772; 21 33.757,51.232; 22 33.757,53.772; 23 36.297,51.232; 24 36.297,53.772; 25 38.837,51.232; 26 38.837,53.772; 27 41.377,51.232; 28 41.377,53.772; 29 43.917,51.232; 30 43.917,53.772; 31 46.457,51.232; 32 46.457,53.772; 33 48.997,51.232; 34 48.997,53.772; 35 51.537,51.232; 36 51.537,53.772; 37 54.077,51.232; 38 54.077,53.772; 39 56.617,51.232; 40 56.617,53.772 | hole 2.75: 3.5,3.5; 61.5,3.5; 3.5,52.5; 61.5,52.5
IPL7X2 = drill 1.016 pad 1.524: 1 2.032,3.81; 2 2.032,1.27; 3 4.572,3.81; 4 4.572,1.27; 5 7.112,3.81; 6 7.112,1.27; 7 9.652,3.81; 8 9.652,1.27; 9 12.192,3.81; 10 12.192,1.27; 11 14.732,3.81; 12 14.732,1.27; 13 17.272,3.81; 14 17.272,1.27
XTAL_ECS-80-S-4X = drill 0.63 pad 1.03: 1 -2.44,0; 2 2.44,0

### Placement (x,y rotation side)
C1  26.29,63.75 180 bottom
C2  19.56,63.75 0 bottom
C3  34.8,45.72 0 top
C4  24.89,42.16 90 bottom
C5  31.5,65.15 270 bottom
C6  34.67,65.91 180 top
C7  4.19,12.06 90 top
C8  20.45,17.27 0 bottom
C9  20.07,23.24 180 bottom
C10  17.96,11.63 90 top
C13  44.96,37.85 270 bottom
C14  17.98,7.9 90 top
C15  65.53,34.29 270 top
D1  30.73,42.93 90 top
D2  35.05,70.1 270 top
D3  6.22,46.35 270 top
D4  28.91,17.45 270 top
D5  66.93,70.23 270 top
J1  66.42,42.8 90 top
J2  20.19,29.59 0 top
J3  4.19,26.04 270 top
J4  34.67,59.44 270 top
J5  67.56,61.59 270 top
J6  40.77,56.52 180 top
J7  62.74,45.34 270 top
J8  4.19,36.2 270 top
J9  30.33,26.16 180 top
J10  41.02,66.04 0 top
J11  41.02,58.67 0 top
J12  7.49,48.9 90 top
J13  60.96,49.91 180 top
J14  43.18,49.91 180 top
J15  52.07,49.91 180 top
Q1  40.51,18.41 270 bottom
Q2  38.73,11.43 0 bottom
Q3  40.51,14.86 270 bottom
Q4  38.73,69.72 90 top
Q5  26.97,14.48 90 bottom
R1  26.54,42.16 270 top
R2  28.96,42.16 270 top
R3  39.73,61.21 270 bottom
R4  38.35,69.72 90 bottom
R5  32.26,70.23 90 top
R6  38.1,63.25 0 top
R7  38.1,65.28 180 top
R8  48.26,33.4 180 bottom
R9  46.61,30.99 0 bottom
R10  21.21,39.37 180 top
R11  23.88,61.09 270 top
R12  45.47,15.88 0 bottom
R13  36.6,14.88 90 bottom
R14  36.83,18.41 270 bottom
R15  45.54,19.51 0 bottom
R16  24.13,14.48 90 bottom
R17  26.42,17.27 180 bottom
R18  17.4,2.29 0 top
R19  21.97,61.09 270 top
R20  48.39,28.7 180 bottom
R21  17.4,4.32 0 top
R22  33.66,7.52 270 top
R23  24.89,7.11 90 bottom
R24  27.18,8.76 270 bottom
R25  43.05,11.56 0 bottom
R26  3.68,46.35 270 bottom
R27  62.23,71.12 180 top
U1  21.34,19.94 180 bottom
U3  61.72,18.29 180 top
U$1  21.08,57.53 270 top
U$2  34.29,67.31 180 bottom
U$4  35.31,47.75 270 top
U$5  40.51,47.12 270 top
U$6  36.7,5.46 90 top
U$7  26.67,7.62 180 top
U$8  65.41,3.94 90 top
U$9  58.17,8.76 180 top
Y1  22.86,65.79 0 top

### Tracks (layer width: path | path; a pad name or v marks a point on that pad's centre or on a via)
3V3  (via drill 0.45, 0.65, 0.75)
  Top 0.508: D1.C 30.18,41.78 29.72,41.31 R2.2
  Top 0.635: v33.53,70.61 33.06,71.08 R5.2 31.46,71.08 31,70.62 31,70.29 30.46,69.75 30.46,68.59 v30.48,68.58
  Top 0.762: J2.3 25.22,29.64 25.22,31.57 26.16,32.51 30.48,32.51 32.51,34.54 32.51,39.12 | U$5.VIN U$4.VIN 35.81,40.13 33.95,42 | R27.2 61.13,71.37 45.22,71.37 v44.38,70.54 | U$1.18 31.24,46.61 32.13,45.72 C3.1 | C3.1 33.95,42 | 33.95,42 33.95,41.57 32.51,40.13 32.51,39.12 | C3.1 34.06,45.83 34.06,46.44 38.18,50.56 38.18,51.28 v38.15,51.31 | v46.74,11.68 46.74,10.92 43.43,7.62 U$9.12 | R2.2 28.96,39.88 29.72,39.12 32.51,39.12
  Bottom 0.508: R3.2 38.09,60.81 37.99,60.71
  Bottom 0.635: R4.2 37.3,70.57 36.58,69.85 34.29,69.85 v33.53,70.61 | C5.1 30.77,66 30.48,66.29 v30.48,68.58
  Bottom 0.762: C5.1 34.25,66 U$2.3 36.58,66.04 37.99,64.63 37.99,60.71 37.99,56.76 J6.2 38.15,56.44 38.15,54.1 | J7.2 62.74,40.89 63.25,40.39 67.56,40.39 68.38,41.2 68.38,48.46 J1.4 65.02,51.82 58.93,51.82 | v44.38,70.54 44.35,70.57 R4.2 | 58.93,51.82 50.29,51.82 | U$5.VIN 43.52,40.13 C13.1 46.14,38.7 47.41,37.43 R8.1 47.41,31.04 | R9.1 47.41,31.04 | 47.41,31.04 47.41,28.83 R20.1 47.54,25.65 44.65,22.77 R15.2 | J14.1 41.3,51.66 | J13.1 59.09,51.66 58.93,51.82 | J15.1 50.2,51.72 50.29,51.82 | 50.29,51.82 41.46,51.82 41.3,51.66 | v38.15,51.31 38.15,54.1 | R15.2 44.69,15.95 R12.2 | R12.2 44.62,13.29 43.9,12.57 R25.1 44.03,11.68 v46.74,11.68 | Q1.1 44.55,19.36 R15.2 | Q3.1 44.55,15.81 R12.2 | 41.3,51.66 41.3,53.18 40.39,54.1 38.15,54.1
5V  (via drill 0.35, 0.5, 0.65, 0.75)
  Top 0.508: 33.54,8.26 34.16,8.26 36.2,6.22 47.24,6.22 U$9.8
  Top 0.635: U$7.10 23.5,10.79 v24.89,9.4 25.91,8.38 25.91,5.59 26.8,4.7 | R18.2 24.38,2.29 26.8,4.7 | R22.1 33.54,8.26 U$7.5 | v33.93,14.05 32.69,14.05 32.26,14.48 31.27,13.49 U$7.8 U$7.7 U$7.6 U$7.5 | 26.8,4.7 29.21,7.11 29.21,7.87 29.59,8.26 U$7.5
  Top 0.762: C10.1 17.97,10.79 20.32,10.79 | v35.31,19.3 32.26,19.3 | R18.2 18.25,1.31 17.78,0.84 1.96,0.84 0.84,1.96 v0.84,45.47 0.84,53.14 J12.1 | U$7.10 20.32,10.79 | v20.57,14.22 20.39,14.04 20.39,10.86 20.32,10.79
  Top 1.016: R21.2 R18.2
  Top 1.651: 32.26,14.48 32.26,19.3 32.26,20.57 28.7,20.57 27.79,21.49 J9.2
  Top 1.778: J2.4 27.81,26.19 J9.2
  Bottom 0.508: R23.2 v24.89,9.4 | R16.2 23.03,15.33 22.35,16 21.3,17.06 C8.1 21.34,17.31 21.34,18.03 22.25,18.95 | 22.25,18.95 U1.8 | 22.25,18.95 22.2,18.95 20.22,20.93 U1.4 19.15,23.18 C9.1
  Bottom 0.635: R16.2 24.23,15.43 Q5.2
  Bottom 0.762: R26.2 3.64,45.47 v0.84,45.47 | R14.1 35.34,19.27 v35.31,19.3 | R13.1 33.95,14.03 v33.93,14.05 | 22.35,16 v20.57,14.22
5V_RAW
  Top 0.635: U$7.4 33.34,6.99 R22.2
  Top 0.762: U$7.1 U$7.2 U$7.3 U$7.4
12V  (via drill 0.76 pad 1.3, 1.27)
  Top 0.762: U3.9 v61.72,22.73
  Top 1.27: v64.52,26.92 65.53,27.94 C15.+
  Bottom 1.27: U$9.4 U$9.2 61.72,13.08 v61.72,22.73 61.72,24.13 v64.52,26.92
!AMP_FAULT  (via drill 0.35)
  Top 0.254: U$7.9 22.07,12.67 v22.61,13.21
  Bottom 0.254: v22.61,13.21 22.92,13.53 24.13,13.53 R16.1 24.2,13.55 25.95,13.55 Q5.1
!AMP_RESET  (via drill 0.35)
  Top 0.254: U$6.1 35.84,2.46 v33.76,4.55
  Bottom 0.254: U$8.7 14.99,19.1 14.99,18.54 19.05,14.48 19.05,5.59 19.56,5.08 23.37,5.08 24.31,4.14 33.35,4.14 v33.76,4.55 36.07,6.86 38.35,6.86 42.2,10.71 42.2,11.43 | R25.2 42.2,11.43 | Q2.1 40.4,10.43 41.4,11.43 42.2,11.43
A_INT
  Bottom 0.254: U$8.26 10.16,41.3 10.16,34.8 11.18,33.78 16.26,33.78 18.54,31.5 30.73,31.5 33.53,34.29 33.53,39.62 36.32,42.42 49.02,42.42 50.8,40.64 50.8,35.56 51.31,35.05 U$4.AI1
AIN2  (via drill 0.35)
  Top 0.254: J2.2 22.73,27.3 19.81,24.38 18.03,24.38 17.53,23.88 v17.53,22.86
  Bottom 0.254: v17.53,22.86 17.53,20.83 18.09,20.27 U1.3
AMP_OUT  (via drill 0.35)
  Top 0.254: U$7.12 20.19,8.26 19.81,8.64 v19.81,9.4
  Bottom 0.254: v19.81,9.4 19.56,9.65 19.56,15.24 16.76,18.03 16.76,19.05 17.32,19.61 U1.2
CAN_H  (via drill 0.35)
  Top 0.254: R6.2 41.15,63.25 v41.4,63.5 | J5.2 67.56,56.9 66.8,56.13 64.26,56.13 64.01,55.88 64.01,54.36 64.26,54.1 67.31,54.1 68.76,52.65 68.76,9.58 62.74,3.56 v40.89,3.56
  Bottom 0.254: J5.2 53.54,59.05 J11.2 J10.2 51.12,69.28 50.42,69.98 46.61,69.98 41.4,64.77 | 41.4,64.77 U$2.7 | v41.4,63.5 41.4,64.77 | v40.89,3.56 U$9.13
CAN_L  (via drill 0.35)
  Top 0.254: R7.1 41.15,65.28 41.66,65.79 v41.66,66.04 | J5.1 69.27,59.89 69.27,9.32 63.02,3.07 42.41,3.07 v42.22,2.87
  Bottom 0.254: J5.1 65.66,61.59 63.75,59.69 54.86,59.69 54.86,59.73 J11.3 J10.3 53.12,69.56 52.07,70.61 46.23,70.61 v41.66,66.04 U$2.6 | U$9.14 41.78,7.49 42.22,7.06 v42.22,2.87
CAN_RESET
  Top 0.254: U$8.15 20.36,36.26 R10.2
CAN_SILENT
  Bottom 0.254: R3.1 39.73,63.46 U$2.8
CAN_TERM_COM
  Top 0.254: R6.1 R7.2 36.58,65.28 36.32,65.02 35.81,65.02 35.52,65.32 C6.1
CLK
  Top 0.254: J4.2 33.02,56.9 30.99,54.86 26.92,54.86 24.89,52.83 U$1.13 24.89,46.74 24.38,46.23 18.8,46.23 18.29,45.72 18.29,42.42 16.1,40.23 U$8.23
CS  (via drill 0.35)
  Top 0.254: J4.5 32.13,51.82 29.72,51.82 28.7,50.8 U$1.16 28.7,46.74 25.91,43.94 22.35,43.94 v21.59,43.18
  Bottom 0.254: U$8.24 12.36,40.23 13.72,41.59 14.92,41.59 16.51,43.18 v21.59,43.18
DI1
  Top 0.254: J12.2 8.21,55.47 U$8.36
DI2
  Top 0.254: J12.3 7.67,58.01 U$8.38
FAULT  (via drill 0.35)
  Top 0.254: v37.59,67.82 39.37,67.82 39.73,68.18 Q4.1
  Bottom 0.254: U$2.5 38.1,67.31 v37.59,67.82 37.59,68.58 37.85,68.83 38.31,68.83 R4.1
GND  (via drill 0.35)
  other vias: 23.62,17.53 20.32,15.75
  pour Top (rank 6): -1.27,-1.27 -1.27,74.93 71.12,74.93 71.12,-2.54 -1.27,-2.54
  pour Bottom (rank 6): -2.54,72.39 -2.54,-1.27 -1.27,-2.54 69.85,-2.54 73.66,1.27 73.66,73.66 72.39,74.93 0,74.93
GPIO1  (via drill 0.35)
  Top 0.254: U3.1 65.41,13.84 65.53,13.72 v65.53,10.41 | v55.12,2.29 54.86,2.54 42.85,2.54 42.5,2.19 40.99,2.19 v39.88,3.3
  Bottom 0.254: v65.53,10.41 65.53,8.38 60.47,3.32 56.15,3.32 v55.12,2.29 | v39.88,3.3 28.79,3.3 28.67,3.43 27.72,3.43 27.19,2.9 14.12,2.9 9.65,7.37 9.65,23.37 11.28,24.99 U$8.12
GPIO2  (via drill 0.35)
  Top 0.254: U3.2 65.66,15.11 66.29,14.48 v66.29,11.43 | v56.9,2.29 56.21,1.6 54.84,1.6 54.7,1.73 39.92,1.73 v39.37,2.29 | v9.65,28.19 11.53,30.07 U$8.16
  Bottom 0.254: v66.29,11.43 66.29,8.38 60.78,2.87 58.65,2.87 58.07,2.29 v56.9,2.29 | v39.37,2.29 29.16,2.29 28.48,2.97 27.91,2.97 27.38,2.44 13.93,2.44 9.2,7.18 9.2,23.56 9.65,24.02 v9.65,28.19
GPIO3  (via drill 0.35)
  Top 0.254: U3.3 65.66,16.38 67.06,14.99 v67.06,12.45 | v58.93,2.18 57.61,0.86 29.62,0.86 v28.19,2.29 | v8.64,30.48 10.77,32.61 U$8.18
  Bottom 0.254: v67.06,12.45 67.06,8.38 60.91,2.23 58.98,2.23 v58.93,2.18 | v28.19,2.29 27.89,1.98 13.74,1.98 8.64,7.09 v8.64,30.48
GPIO4  (via drill 0.35)
  Top 0.254: U3.4 65.41,17.65 67.82,15.24 v67.82,13.46 | v8.59,37.69 U$8.22
  Bottom 0.254: v67.82,13.46 67.82,8.38 60.94,1.5 24.92,1.5 24.89,1.52 13.55,1.52 7.95,7.12 7.95,30.76 8.59,31.39 v8.59,37.69
GPIO5  (via drill 0.35)
  Top 0.254: U3.5 65.41,18.92 v67.56,16.76 | U$8.32 10.77,49.53 v8.64,49.53
  Bottom 0.254: v67.56,16.76 68.56,15.77 68.56,8.36 61.24,1.04 13.39,1.04 7.5,6.94 7.5,30.95 7.87,31.33 7.87,38.35 8.64,39.12 v8.64,49.53
GPIO6  (via drill 0.35)
  Top 0.254: U3.6 65.41,20.19 v67.31,18.29
  Bottom 0.254: v67.31,18.29 69.09,16.51 69.09,8.24 61.43,0.58 13.2,0.58 7.04,6.75 7.04,38.53 7.95,39.45 7.95,49.81 9.91,51.77 9.91,58.83 U$8.40
IMU_INT  (via drill 0.35)
  Top 0.254: U$5.INT 57.91,32.51 55.37,29.97 U$4.GI1 52.32,29.97 51.31,30.99 51.31,34.04 49.78,35.56 45.21,35.56 43.43,33.78 35.56,33.78 32.51,30.73 v32.51,26.42
  Bottom 0.254: U$8.13 17.93,27.53 18.8,26.67 21.08,26.67 22.94,24.82 31.93,24.82 32.51,25.4 v32.51,26.42
IMU_RESET
  Bottom 0.254: U$8.11 17.63,24.99 18.54,25.91 20.83,25.91 23.62,23.11 24.38,23.11 24.74,23.47 33.38,23.47 37.34,27.43 U$4.RST U$5.RST
INT
  Top 0.254: U$1.12 23.62,50.8 16.41,58.01 U$8.37
MISO
  Top 0.254: J4.4 36.07,51.82 36.32,52.07 36.32,52.83 36.07,53.09 28.7,53.09 27.43,51.82 U$1.15 27.43,46.99 25.15,44.7 20.07,44.7 19.81,44.45 19.81,41.4 16.1,37.69 U$8.21
MOSI
  Top 0.254: J4.3 27.94,54.36 26.16,52.58 U$1.14 26.16,46.48 25.15,45.47 19.56,45.47 19.05,44.96 19.05,42.16 15.75,38.86 13.46,38.86 12.95,38.35 12.95,36.37 U$8.19
N$1
  Bottom 0.254: R20.2 50,27.94 57.53,27.94 U$5.ADR
N$2  (via drill 0.35)
  Top 0.254: R11.1 24.85,61.94 v25.4,62.48
  Bottom 0.254: v25.4,62.48 25.4,63.72 C1.1 25.3,63.89 Y1.2
N$3  (via drill 0.35)
  Top 0.254: R19.1 21.12,61.94 v20.57,62.48
  Bottom 0.254: v20.57,62.48 20.41,62.65 C2.1 20.41,65.77 Y1.1
N$6
  Top 0.254: C14.1 18.05,6.99 U$7.13
N$7
  Top 0.762: D2.C 35.34,70.87 36.49,70.87 Q4.3
N$8
  Top 0.635: R5.1 33.23,69.38 33.61,69 D2.A
N$9  (via drill 0.35)
  Top 0.254: v5.05,47.22 5.07,47.23 D3.A
  Bottom 0.254: R26.1 5.04,47.2 v5.05,47.22
N$10
  Bottom 0.254: Q5.3 27.27,15.29 R17.2
N$11  (via drill 0.35)
  Top 0.254: v26.42,18.3 26.44,18.33 D4.A
  Bottom 0.254: R17.1 25.57,17.95 25.92,18.3 v26.42,18.3
N$12
  Top 0.254: R27.1 66.92,71.12 D5.A
N$13
  Bottom 0.254: Q2.3 36.32,12.52 35.23,11.43 29.72,11.43 27.9,9.61 R24.1
OCD  (via drill 0.35)
  Top 0.254: U$7.16 23.24,3.17 v24.89,4.83
  Bottom 0.254: v24.89,4.83 R23.1 24.98,6.35 26.67,6.35 27.18,6.86 R24.2
OSC1
  Top 0.254: U$1.8 22.35,58.8 21.97,59.18 R19.2
OSC2
  Top 0.254: U$1.7 23.62,58.93 23.88,59.18 R11.2
PI_POWER
  Top 1.016: R18.1 R21.1
  Top 1.778: U$8.4 U$8.2 8.19,8.85 C7.+ 4.19,6.3 7.19,3.3 13.97,3.3 14.99,4.32 R21.1
PWM
  Bottom 0.254: U$8.33 12.8,51.56 10.67,51.56 9.4,50.29 9.4,29.97 10.67,28.7 18.03,28.7 19.3,27.43 21.44,27.43 22.86,26.01 25.09,26.01 J9.3
RESET
  Top 0.254: R1.1 26.54,43.31 29.97,46.74 U$1.17
RESET_MID  (via drill 0.35)
  Top 0.254: R10.1 22.06,40.02 v23.39,41.35 26.51,41.35 R1.2 26.63,41.4 27.43,41.4 27.69,41.66 27.69,42.67 28.03,43.01 R2.1 28.96,43.94 29.09,44.08 D1.A
  Bottom 0.254: C4.1 23.43,41.31 v23.39,41.35
RX
  Top 0.254: J8.2 8.89,28.96 8.89,24.13 10.57,22.45 U$8.10
RX0_INT
  Top 0.254: U$1.11 22.35,50.04 16.92,55.47 U$8.35
RX1_INT
  Top 0.254: U$8.29 20.8,47.85 U$1.10
RXCAN  (via drill 0.35)
  Top 0.254: U$1.2 29.97,58.93 30.99,59.94 30.99,61.21 29.21,62.99 29.21,66.8 29.72,67.31 v31.5,67.31
  Bottom 0.254: v31.5,67.31 U$2.4
SCL  (via drill 0.35)
  Top 0.254: J1.2 65.15,45.34 64.52,45.97 64.52,49.66 63.31,50.87 61.29,50.87 J13.2 60.34,50.41 59.94,50.8 52.33,50.8 J15.2 51.45,50.41 51.05,50.8 43.44,50.8 J14.2 42.55,49.14 44.7,46.99 44.7,45.72 46.48,43.94 48.26,43.94 49.53,42.67 49.53,42.16 48.26,40.89 48.26,38.86 46.23,36.83 v46.23,36.32 | v23.88,27.69 20.83,24.64 20.83,22.86 20.07,22.1 16.76,22.1 16.26,21.59 16.26,18.03 14.99,16.76 14.53,16.76 14.17,17.12 U$8.5 13.01,18.54 9.14,18.54 J3.2 | v47.24,22.35 47.24,23.88 45.72,25.4 v45.72,28.19 | v43.18,17.53 v46.23,17.53
  Bottom 0.254: v45.72,28.19 45.72,30.95 R9.2 | v23.88,27.69 24,27.81 30.35,27.81 32,29.46 33.27,29.46 36.32,32.51 U$4.SCL 39.37,32.51 41.78,30.1 U$5.SCL 43.69,29.97 44.7,30.99 R9.2 | v47.24,22.35 47.24,21.12 46.46,20.34 46.46,19.58 | 46.46,19.58 R15.1 | Q1.2 43.12,17.46 v43.18,17.53 | v46.23,17.53 46.46,17.76 46.46,19.58 | v46.23,36.32 46.23,35.56 44.7,34.04 44.7,32.77 45.76,31.71 R9.2
SCL_ADC
  Bottom 0.254: U1.5 24.03,20.93 26.06,22.96 31.5,22.96 33.4,21.06 33.4,18.67 34.51,17.57 R14.2 38.56,17.57 Q1.3
SDA  (via drill 0.35)
  Top 0.254: J3.3 8.95,16.19 12.27,16.19 13.63,14.83 U$8.3 15.34,14.83 18.8,18.29 19.81,18.29 23.11,21.59 23.11,23.09 v23.88,23.85 | U$4.SDA 39.24,29.97 U$5.SDA 43.43,32.51 44.32,33.4 v50.44,33.4 50.44,30.33 51.05,29.72 51.05,26.16 v50.29,25.4 | 58.8,48.39 58.17,49.02 53.58,49.02 J15.3 51.82,49.02 44.69,49.02 J14.3 43.8,49.16 50.04,42.93 50.04,41.4 49.02,40.39 v49.02,39.62 | 58.8,48.39 59.69,47.5 v61.47,47.5 | v42.93,13.97 46.23,13.97 v46.48,14.22 | J13.3 60.7,49.02 59.44,49.02 58.8,48.39
  Bottom 0.254: v50.44,33.4 R8.2 49.02,33.49 v49.02,39.62 | U$4.SDA 32,24.13 24.13,24.13 24.13,24.1 v23.88,23.85 | v50.29,25.4 48.26,23.37 48.26,16.76 47.37,15.88 R12.1 46.48,15.71 v46.48,14.22 | Q3.2 41.57,13.97 v42.93,13.97 | v61.47,47.5 61.85,47.88 J1.3
SDA_ADC
  Bottom 0.254: Q3.3 38.48,14.86 37.61,15.73 R13.2 31.51,15.73 30.48,16.76 30.48,18.54 29.72,19.3 28.19,19.3 27.18,20.32 23.57,20.32 U1.6
SOL1_1
  Top 0.254: U3.16 57.78,13.84 57.38,13.44 57.38,5.69 56.64,4.95 U$9.1
SOL2_1
  Top 0.254: U3.15 57.53,15.11 54.86,12.45 54.86,5.59 54.23,4.95 U$9.3
SOL3_1
  Top 0.254: U3.14 57.78,16.38 52.32,10.92 52.32,6.1 51.18,4.95 U$9.5
SOL4_1
  Top 0.254: U3.13 57.53,17.65 49.94,10.06 49.94,6.38 U$9.7
SOL5_1  (via drill 0.35)
  Top 0.254: v57,18.95 59.22,18.95 U3.12
  Bottom 0.254: U$9.9 46.86,4.95 48.01,6.1 49.02,6.1 49.66,6.73 49.66,11.61 v57,18.95
SOL6_1  (via drill 0.35)
  Top 0.254: U3.11 59.22,20.17 v56.9,20.17
  Bottom 0.254: U$9.11 44.43,4.95 45.52,6.04 46.18,6.04 47.24,7.11 47.24,10.52 v56.9,20.17
TX
  Top 0.254: J8.3 4.95,31.11 8.13,27.94 8.13,23.16 11.38,19.91 U$8.8
TXCAN  (via drill 0.35)
  Top 0.254: v28.96,55.88 30.73,55.88 31.24,56.39 U$1.1
  Bottom 0.254: v28.96,55.88 28.7,55.88 28.04,56.54 28.04,59.03 32.51,63.5 U$2.1

### Text on the board
tPlace: CAN_L | GND | 3.3V | GND | CAN_H | CLK | MOSI | MISO | 3.3V | CS | SDA | GND | SCL | 3.3V | 3.3V | GND | GND | RX | TX | GND | AIN2 | 3.3V | 5V | GND | PWM | 5V | GND | SCL | SDA
tNames: X14 Pi-Shield v1 / Rachel Livesay / Erin Park / Katherine Sandys / Read Hedl / 3/14/2022